# Altium schematic sheet accel.SchDoc
size A4; SheetNumber: 5; SheetTotal: 6
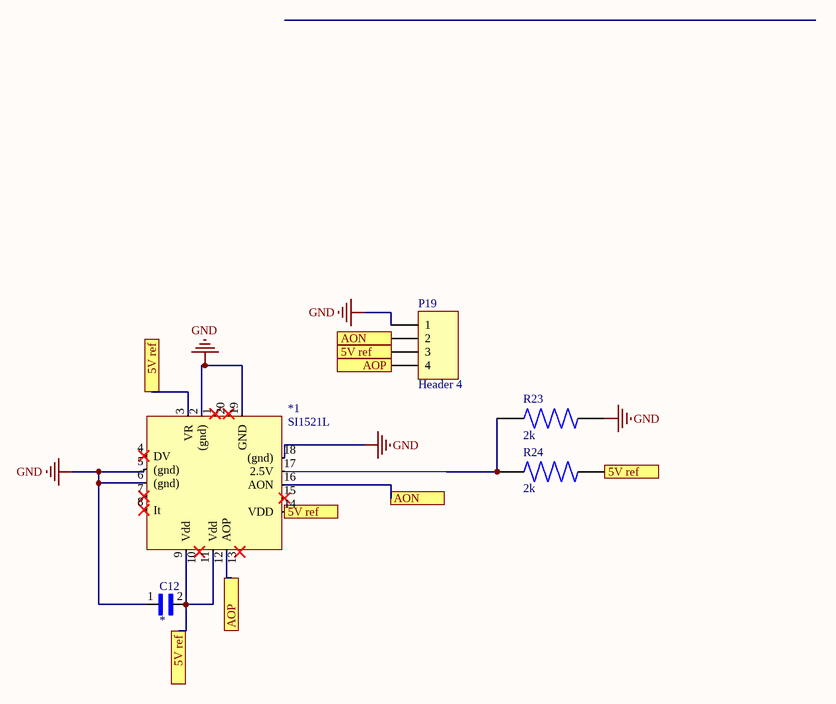
[diagram p0: accel.SchDoc]

## Parts
*1  SI1521L  [LCC127P889X889X254-20N]
C12  0.1uF  [CAPC1608X90N]  (value not drawn)
P19  Header 4  [HDR1X4]
R23  2k  [RESC1608X55N]
R24  2k  [RESC1608X55N]

## Ports
5V ref, AON, AOP

## Nets
GND: *1.2((gnd)) *1.5((gnd)) *1.6((gnd)) *1.18((gnd)) *1.19(GND) C12.1 P19.1 R23.2
5V ref: *1.3(VR) *1.9(Vdd) *1.11(Vdd) *1.14(VDD) C12.2 P19.3 R24.2 ; port 5V ref
AON: *1.16(AON) P19.2 ; port AON
AOP: *1.12(AOP) P19.4 ; port AOP
Net*1_17: *1.17(2.5V) R23.1 R24.1

Not connected (* = marked no-connect by the designer): *1 1* 4(DV)* 7* 8(It)* 10* 13* 15* 20*

## Library data of the parts
*1 = CMP-010-00024-2: Silicon Design SI-1521L-002 +- 2g LCC-20 Surface mount accelerometer
C12 = CMP-003-000001-1: Cap Ceramic 0.1uF 25V X5R 10% SMD 0603 85ÂÂŽ T/R; MF: {'manufacturer': u'AVX'}; Design Item ID: 06033D104KAT2A; Value: *; Package: None; Source: workerBoard.SCHLIB; Price: None; MP: 06033D104KAT2A; Pin Count: 2; Component Type: Standard; Availability: Unavailable
P19 = CMP-004-000000-1: Header, 4-Pin; Signal Integrity: Connector; LatestRevisionDate: 17-Jul-2002; LatestRevisionNote: Re-released for DXP Platform.; Publisher: Altium Limited; Component Type: Standard; Design Item ID: Header 4; Pin Count: 4; Source: workerBoard.SCHLIB
R23 R24 = CMP-008-000005-1: RES SMD 33 OHM 0.1% 1/10W 0603; MP: RT0603BRD0733RL; MF: {'manufacturer': u'Yageo'}; Price: None; Availability: Unavailable; Value: *; Package: None; Component Type: Standard; Design Item ID: RT0603BRD0733RL_1; Pin Count: 2; Source: workerBoard.SCHLIB